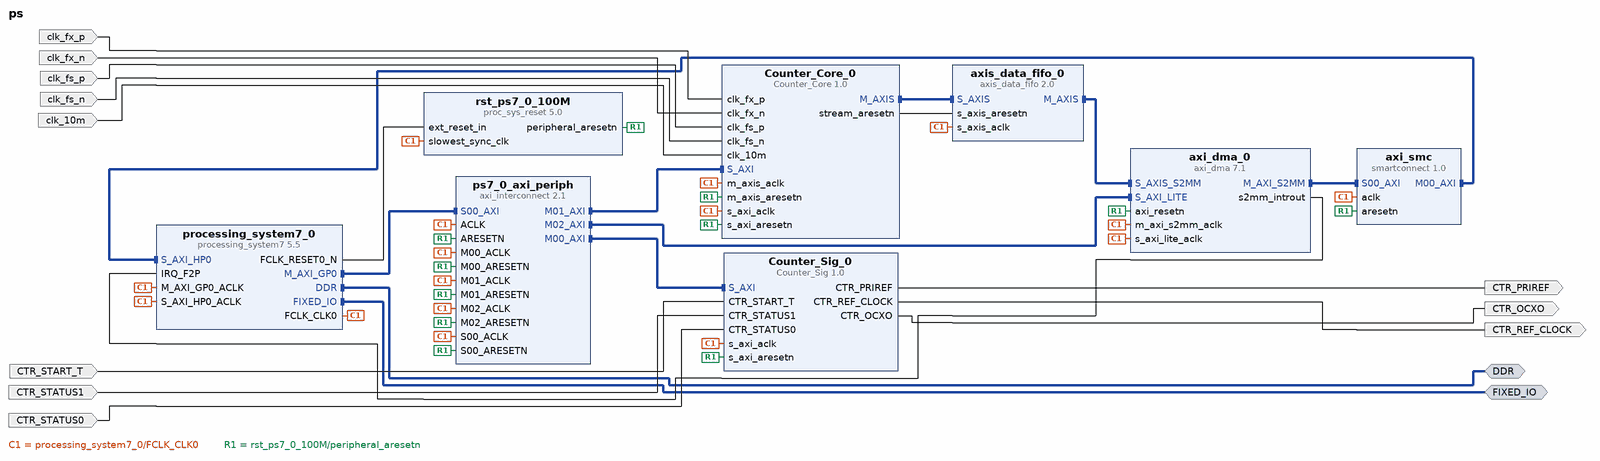
[diagram p0: block diagram of the top level]
# Vivado block design ps, xc7z020clg400-2, Vivado 2018.3
create_bd_design ps

create_bd_intf_port -mode Master -vlnv xilinx.com:interface:ddrx_rtl:1.0 DDR
create_bd_intf_port -mode Master -vlnv xilinx.com:display_processing_system7:fixedio_rtl:1.0 FIXED_IO
create_bd_port -dir O CTR_PRIREF
create_bd_port -dir I CTR_START_T
create_bd_port -dir I CTR_STATUS1
create_bd_port -dir I CTR_STATUS0
create_bd_port -dir O CTR_REF_CLOCK
create_bd_port -dir O CTR_OCXO
create_bd_port -dir I clk_fx_p
create_bd_port -dir I clk_fx_n
create_bd_port -dir I clk_fs_p
create_bd_port -dir I clk_fs_n
create_bd_port -dir I clk_10m

create_bd_cell -type ip -vlnv xilinx.com:ip:processing_system7:5.5 processing_system7_0
set_property -dict [list \
  CONFIG.PCW_ENET0_ENET0_IO {MIO 16 .. 27} \
  CONFIG.PCW_ENET0_GRP_MDIO_ENABLE 1 \
  CONFIG.PCW_ENET0_GRP_MDIO_IO {MIO 52 .. 53} \
  CONFIG.PCW_ENET0_PERIPHERAL_ENABLE 1 \
  CONFIG.PCW_ENET0_RESET_ENABLE 0 \
  CONFIG.PCW_ENET_RESET_ENABLE 1 \
  CONFIG.PCW_ENET_RESET_SELECT {Share reset pin} \
  CONFIG.PCW_FPGA0_PERIPHERAL_FREQMHZ 100 \
  CONFIG.PCW_FPGA1_PERIPHERAL_FREQMHZ 180 \
  CONFIG.PCW_GPIO_MIO_GPIO_ENABLE 1 \
  CONFIG.PCW_GPIO_MIO_GPIO_IO MIO \
  CONFIG.PCW_I2C0_GRP_INT_ENABLE 0 \
  CONFIG.PCW_I2C0_I2C0_IO {MIO 30 .. 31} \
  CONFIG.PCW_I2C0_PERIPHERAL_ENABLE 1 \
  CONFIG.PCW_I2C_PERIPHERAL_FREQMHZ 111.111115 \
  CONFIG.PCW_I2C_RESET_ENABLE 0 \
  CONFIG.PCW_IRQ_F2P_INTR 1 \
  CONFIG.PCW_PRESET_BANK1_VOLTAGE {LVCMOS 1.8V} \
  CONFIG.PCW_QSPI_GRP_SINGLE_SS_ENABLE 1 \
  CONFIG.PCW_QSPI_GRP_SINGLE_SS_IO {MIO 1 .. 6} \
  CONFIG.PCW_QSPI_PERIPHERAL_ENABLE 1 \
  CONFIG.PCW_QSPI_QSPI_IO {MIO 1 .. 6} \
  CONFIG.PCW_SD0_GRP_CD_ENABLE 0 \
  CONFIG.PCW_SD0_GRP_WP_ENABLE 0 \
  CONFIG.PCW_SD0_PERIPHERAL_ENABLE 1 \
  CONFIG.PCW_SD0_SD0_IO {MIO 40 .. 45} \
  CONFIG.PCW_SDIO_PERIPHERAL_FREQMHZ 100 \
  CONFIG.PCW_SINGLE_QSPI_DATA_MODE x4 \
  CONFIG.PCW_UART0_PERIPHERAL_ENABLE 1 \
  CONFIG.PCW_UART0_UART0_IO {MIO 14 .. 15} \
  CONFIG.PCW_UART_PERIPHERAL_FREQMHZ 100 \
  CONFIG.PCW_UIPARAM_DDR_PARTNO {MT41J256M16 RE-125} \
  CONFIG.PCW_USB_RESET_ENABLE 0 \
  CONFIG.PCW_USE_FABRIC_INTERRUPT 1 \
  CONFIG.PCW_USE_S_AXI_HP0 1 \
] [get_bd_cells processing_system7_0]
# 207 more settings of processing_system7_0 are not shown: defaults, MIO pin electricals, DDR timing, and values the tool derives
create_bd_cell -type ip -vlnv xilinx.com:ip:axi_interconnect:2.1 ps7_0_axi_periph
set_property -dict {CONFIG.NUM_MI 3} [get_bd_cells ps7_0_axi_periph]
create_bd_cell -type ip -vlnv xilinx.com:ip:proc_sys_reset:5.0 rst_ps7_0_100M
create_bd_cell -type ip -vlnv xilinx.com:ip:axi_dma:7.1 axi_dma_0
set_property -dict [list \
  CONFIG.c_include_mm2s 0 \
  CONFIG.c_include_sg 0 \
  CONFIG.c_s2mm_burst_size 256 \
  CONFIG.c_sg_length_width 20 \
] [get_bd_cells axi_dma_0]
create_bd_cell -type ip -vlnv xilinx.com:ip:axis_data_fifo:2.0 axis_data_fifo_0
set_property -dict {CONFIG.FIFO_DEPTH 32768 CONFIG.TDATA_NUM_BYTES 8} [get_bd_cells axis_data_fifo_0]
create_bd_cell -type ip -vlnv xilinx.com:ip:smartconnect:1.0 axi_smc
set_property -dict {CONFIG.NUM_SI 1} [get_bd_cells axi_smc]
create_bd_cell -type ip -vlnv xilinx.com:user:Counter_Sig:1.0 Counter_Sig_0
create_bd_cell -type ip -vlnv xilinx.com:user:Counter_Core:1.0 Counter_Core_0

# ---- connections ----

connect_bd_intf_net [get_bd_intf_pins ps7_0_axi_periph/M01_AXI] [get_bd_intf_pins Counter_Core_0/S_AXI]
connect_bd_intf_net [get_bd_intf_pins Counter_Core_0/M_AXIS] [get_bd_intf_pins axis_data_fifo_0/S_AXIS]
connect_bd_intf_net [get_bd_intf_pins axi_smc/M00_AXI] [get_bd_intf_pins processing_system7_0/S_AXI_HP0]
connect_bd_intf_net [get_bd_intf_pins ps7_0_axi_periph/M00_AXI] [get_bd_intf_pins Counter_Sig_0/S_AXI]
connect_bd_intf_net [get_bd_intf_ports DDR] [get_bd_intf_pins processing_system7_0/DDR]
connect_bd_intf_net [get_bd_intf_pins processing_system7_0/M_AXI_GP0] [get_bd_intf_pins ps7_0_axi_periph/S00_AXI]
connect_bd_intf_net [get_bd_intf_pins axi_dma_0/M_AXI_S2MM] [get_bd_intf_pins axi_smc/S00_AXI]
connect_bd_intf_net [get_bd_intf_pins ps7_0_axi_periph/M02_AXI] [get_bd_intf_pins axi_dma_0/S_AXI_LITE]
connect_bd_intf_net [get_bd_intf_pins axis_data_fifo_0/M_AXIS] [get_bd_intf_pins axi_dma_0/S_AXIS_S2MM]
connect_bd_intf_net [get_bd_intf_ports FIXED_IO] [get_bd_intf_pins processing_system7_0/FIXED_IO]
connect_bd_net [get_bd_pins processing_system7_0/FCLK_CLK0] \
  [get_bd_pins processing_system7_0/M_AXI_GP0_ACLK] [get_bd_pins ps7_0_axi_periph/S00_ACLK] \
  [get_bd_pins rst_ps7_0_100M/slowest_sync_clk] [get_bd_pins ps7_0_axi_periph/M00_ACLK] [get_bd_pins ps7_0_axi_periph/ACLK] \
  [get_bd_pins ps7_0_axi_periph/M01_ACLK] [get_bd_pins axi_dma_0/m_axi_s2mm_aclk] [get_bd_pins axi_smc/aclk] \
  [get_bd_pins processing_system7_0/S_AXI_HP0_ACLK] [get_bd_pins axis_data_fifo_0/s_axis_aclk] \
  [get_bd_pins axi_dma_0/s_axi_lite_aclk] [get_bd_pins ps7_0_axi_periph/M02_ACLK] [get_bd_pins Counter_Sig_0/s_axi_aclk] \
  [get_bd_pins Counter_Core_0/s_axi_aclk] [get_bd_pins Counter_Core_0/m_axis_aclk]
connect_bd_net [get_bd_pins processing_system7_0/FCLK_RESET0_N] [get_bd_pins rst_ps7_0_100M/ext_reset_in]
connect_bd_net -net rst_ps7_0_50M_peripheral_aresetn [get_bd_pins rst_ps7_0_100M/peripheral_aresetn] \
  [get_bd_pins ps7_0_axi_periph/S00_ARESETN] [get_bd_pins ps7_0_axi_periph/M00_ARESETN] \
  [get_bd_pins ps7_0_axi_periph/ARESETN] [get_bd_pins ps7_0_axi_periph/M01_ARESETN] [get_bd_pins axi_smc/aresetn] \
  [get_bd_pins axi_dma_0/axi_resetn] [get_bd_pins ps7_0_axi_periph/M02_ARESETN] [get_bd_pins Counter_Sig_0/s_axi_aresetn] \
  [get_bd_pins Counter_Core_0/s_axi_aresetn] [get_bd_pins Counter_Core_0/m_axis_aresetn]
connect_bd_net [get_bd_pins axi_dma_0/s2mm_introut] [get_bd_pins processing_system7_0/IRQ_F2P]
connect_bd_net [get_bd_pins Counter_Sig_0/CTR_PRIREF] [get_bd_ports CTR_PRIREF]
connect_bd_net -net CTR_START_T_0_1 [get_bd_ports CTR_START_T] [get_bd_pins Counter_Sig_0/CTR_START_T]
connect_bd_net -net CTR_STATUS1_0_1 [get_bd_ports CTR_STATUS1] [get_bd_pins Counter_Sig_0/CTR_STATUS1]
connect_bd_net -net CTR_STATUS0_0_1 [get_bd_ports CTR_STATUS0] [get_bd_pins Counter_Sig_0/CTR_STATUS0]
connect_bd_net [get_bd_pins Counter_Sig_0/CTR_REF_CLOCK] [get_bd_ports CTR_REF_CLOCK]
connect_bd_net [get_bd_pins Counter_Sig_0/CTR_OCXO] [get_bd_ports CTR_OCXO]
connect_bd_net -net clk_fx_p_0_1 [get_bd_ports clk_fx_p] [get_bd_pins Counter_Core_0/clk_fx_p]
connect_bd_net -net clk_fx_n_0_1 [get_bd_ports clk_fx_n] [get_bd_pins Counter_Core_0/clk_fx_n]
connect_bd_net -net clk_fs_p_0_1 [get_bd_ports clk_fs_p] [get_bd_pins Counter_Core_0/clk_fs_p]
connect_bd_net -net clk_fs_n_0_1 [get_bd_ports clk_fs_n] [get_bd_pins Counter_Core_0/clk_fs_n]
connect_bd_net -net clk_10m_0_1 [get_bd_ports clk_10m] [get_bd_pins Counter_Core_0/clk_10m]
connect_bd_net [get_bd_pins Counter_Core_0/stream_aresetn] [get_bd_pins axis_data_fifo_0/s_axis_aresetn]

# ---- address map ----
assign_bd_address -offset 0x00000000 -range 1G -target_address_space [get_bd_addr_spaces axi_dma_0/Data_S2MM] [get_bd_addr_segs processing_system7_0/S_AXI_HP0/HP0_DDR_LOWOCM]
assign_bd_address -offset 0x40400000 -range 64K -target_address_space [get_bd_addr_spaces processing_system7_0/Data] [get_bd_addr_segs axi_dma_0/S_AXI_LITE/Reg]
assign_bd_address -offset 0x43C00000 -range 64K -target_address_space [get_bd_addr_spaces processing_system7_0/Data] [get_bd_addr_segs Counter_Sig_0/S_AXI/S_AXI_reg]
assign_bd_address -offset 0x43C10000 -range 64K -target_address_space [get_bd_addr_spaces processing_system7_0/Data] [get_bd_addr_segs Counter_Core_0/S_AXI/S_AXI_reg]

validate_bd_design
save_bd_design
